# EAGLE design Stiquito (EAGLE 4.09)
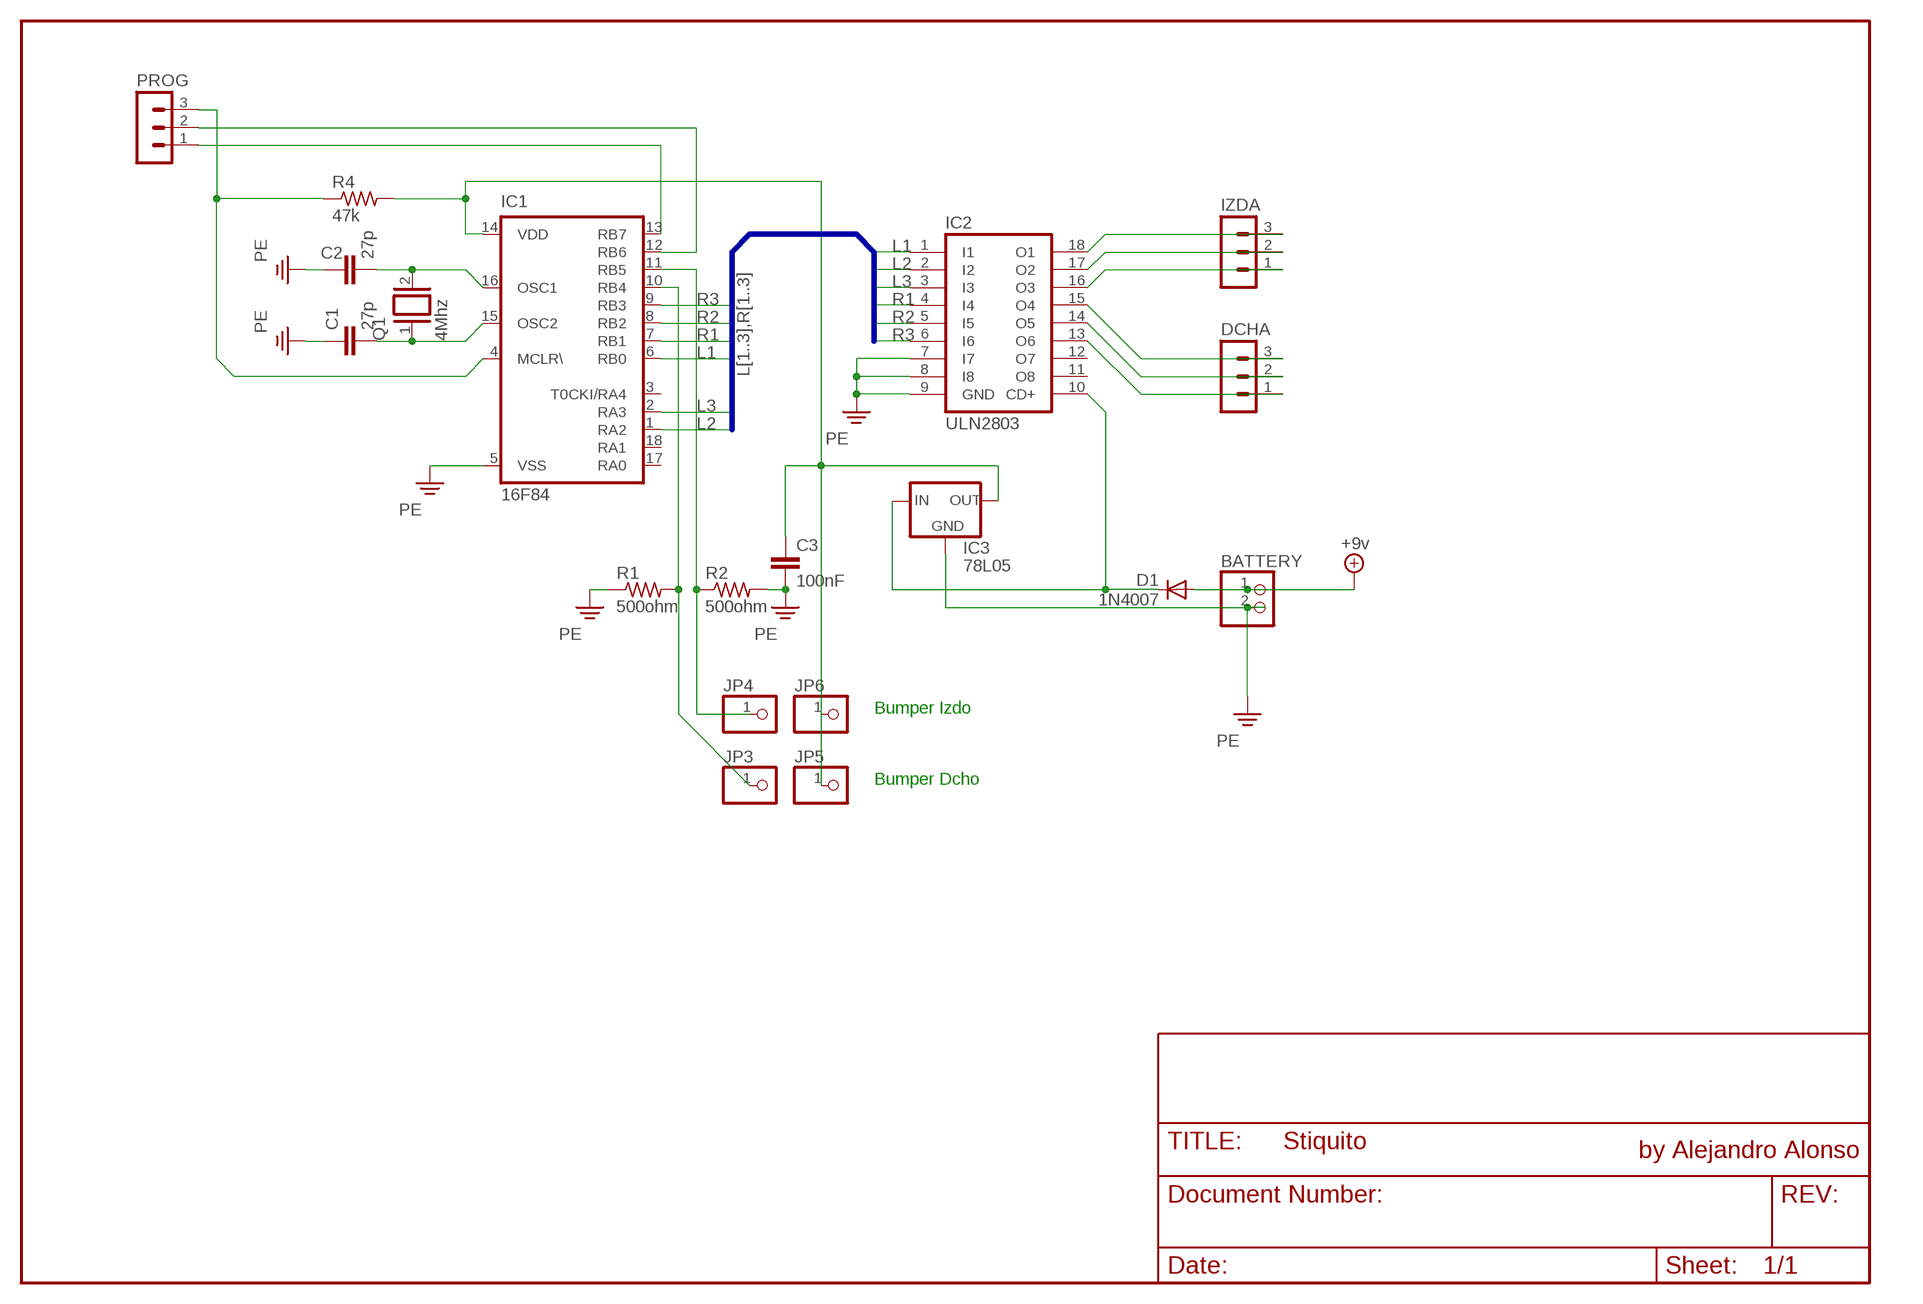
[diagram p0: schematic, sheet 1]

## Parts
BATTERY  PINHD-1X2  [1X02]
C1  27p  C5/2.5  [C5B2.5]
C2  27p  C5/2.5  [C5B2.5]
C3  100nF  C-EU050-030X075  [C050-030X075]
D1  1N4007  1N4004  [DO41-10]
DCHA  MA03-1  [MA03-1]
IC1  16F84  PIC16F84ASO  [SO-18W]
IC2  ULN2803  ULN2803A  [DIL18]
IC3  78L05  78LXX  [78LXX]
IZDA  MA03-1  [MA03-1]
JP3  PINHD-1X1  [1X01]
JP4  PINHD-1X1  [1X01]
JP5  PINHD-1X1  [1X01]
JP6  PINHD-1X1  [1X01]
PROG  MA03-1  [MA03-1]
Q1  4Mhz  XTAL/S  [QS]
R1  500ohm  R-US_0204/2V  [0204V]
R2  500ohm  R-US_0204/2V  [0204V]
R4  47k  R-US_0207/2V  [0207/2V]

## Nets
+5V: BATTERY.1 D1.A ; supply symbol labelled +9v
L1: IC1.6(RB0) IC2.1(I1)
L2: IC1.1(RA2) IC2.2(I2)
L3: IC1.2(RA3) IC2.3(I3)
N$2: IC1.12(RB6) PROG.2
N$6: D1.C IC2.10(CD+) IC3.IN
N$7: C2.2 IC1.16(OSC1) Q1.2
N$8: C1.2 IC1.15(OSC2) Q1.1
N$9: IC1.10(RB4) JP3.1 R1.2
N$10: IC1.11(RB5) JP4.1 R2.1
N$11: C3.1 IC1.14(VDD) IC3.OUT JP5.1 JP6.1 R4.2
N$12: IC2.18(O1) IZDA.3
N$13: IC1.13(RB7) PROG.1
N$15: IC2.17(O2) IZDA.2
N$16: IC2.16(O3) IZDA.1
N$17: DCHA.3 IC2.15(O4)
N$18: DCHA.2 IC2.14(O5)
N$19: DCHA.1 IC2.13(O6)
N$20: IC1.4(MCLR\) PROG.3 R4.1
PE: C1.1 C2.1 C3.2 IC1.5(VSS) IC2.7(I7) IC2.8(I8) IC2.9(GND) IC3.GND R1.1 R2.2
R1: IC1.7(RB1) IC2.4(I4)
R2: IC1.8(RB2) IC2.5(I5)
R3: IC1.9(RB3) IC2.6(I6)
Unconnected: BATTERY.2 IC1.3(T0CKI/RA4) IC1.17(RA0) IC1.18(RA1) IC2.11(O8) IC2.12(O7)

## Buses
L[1..3],R[1..3]

## Notes on the sheet
- Bumper Izdo
- Bumper Dcho
- by Alejandro Alonso

## Library data of the parts
BATTERY = pinhead:PINHD-1X2: PIN HEADER
C1 C2 = capacitor-wima:C: CAPACITOR naming: grid - package width
C3 = rcl:C-EU: CAPACITOR, European symbol
D1 = diode:1N4004: DIODE general purpose rectifier, 1 A
DCHA IZDA PROG = con-lstb:MA03-1: PIN HEADER
IC1 = microchip:PIC16F8*: MICROCONTROLLER 8-Bit PIC16F8X Family - CMOS Flash/EEPROM Pin Compatible : PIC16F83, PIC16CR83, PIC16F84A, PIC16CR84 see also PIC16C*
IC2 = uln-udn:ULN2803A: DRIVER ARRAY
IC3 = v-reg:78LXX: VOLTAGE REGULATOR
JP3-JP6 = pinhead:PINHD-1X1: PIN HEADER
Q1 = special:XTAL/S: CRYSTAL
R1 R2 R4 = rcl:R-US_: RESISTOR, American symbol

## Board
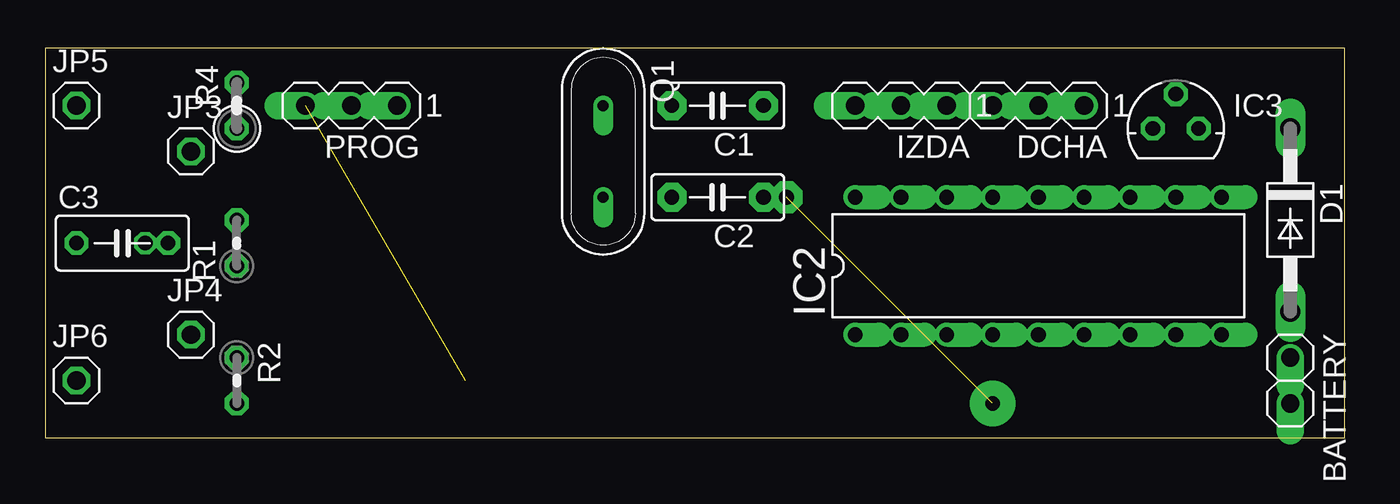
[diagram p1: board, top side]
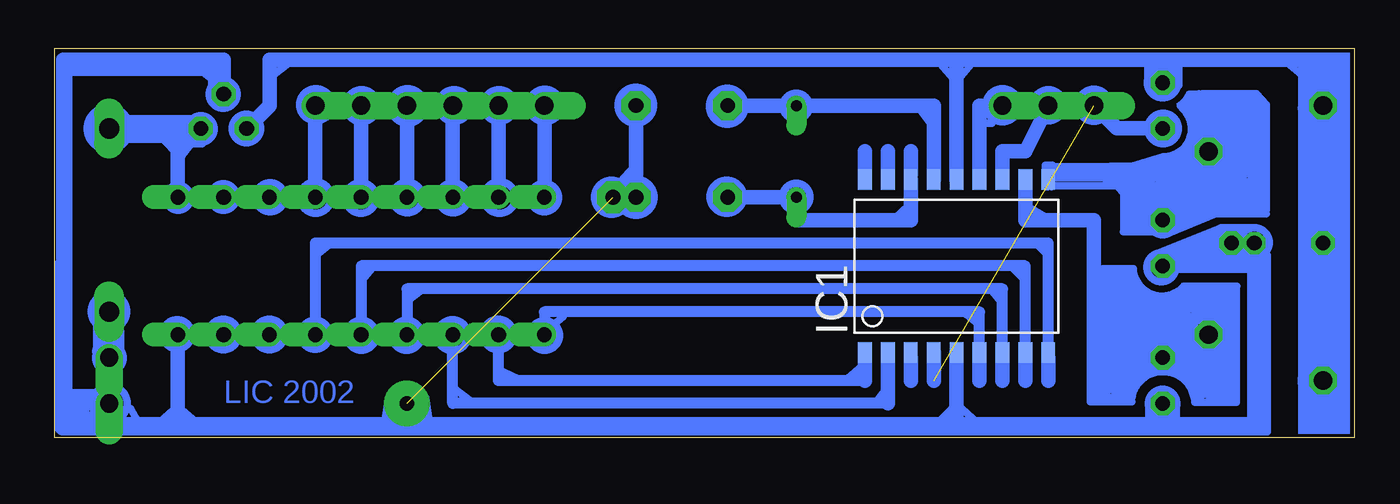
[diagram p2: board, bottom side, seen from below]

Size 72.06 x 21.58 mm. Coordinates in mm from the lower left corner, seen from the top.
Outline: 0,0 72.06,0 72.06,21.58 0,21.58 0,0
Copper layers used: Bottom

### Footprints (pad centres in the part's own frame; a part is rotated, then mirrored left to right if it is on the bottom)
1X02 = drill 1.016 offset: 1 -1.27,0; 2 1.27,0
C5B2.5 = drill 0.813 pad 1.6 octagon: 1 -2.54,0; 2 2.54,0
C050-030X075 = drill 0.813 octagon: 1 -2.54,0; 2 2.54,0
DO41-10 = drill 1.118 long: A 5.08,0; C -5.08,0
MA03-1 = drill 1.016 offset: 1 -2.54,0; 2 0,0; 3 2.54,0
SO-18W = smd 0.762 x 1.143: 1 -5.08,-4.788; 2 -3.81,-4.788; 3 -2.54,-4.788; 4 -1.27,-4.788; 5 0,-4.788; 6 1.27,-4.788; 7 2.54,-4.788; 8 3.81,-4.788; 9 5.08,-4.788; 10 5.08,4.788; 11 3.81,4.788; 12 2.54,4.788; 13 1.27,4.788; 14 0,4.788; 15 -1.27,4.788; 16 -2.54,4.788; 17 -3.81,4.788; 18 -5.08,4.788
DIL18 = drill 0.813 offset: 1 -10.16,-3.81; 2 -7.62,-3.81; 3 -5.08,-3.81; 4 -2.54,-3.81; 5 0,-3.81; 6 2.54,-3.81; 7 5.08,-3.81; 8 7.62,-3.81; 9 10.16,-3.81; 10 10.16,3.81; 11 7.62,3.81; 12 5.08,3.81; 13 2.54,3.81; 14 0,3.81; 15 -2.54,3.81; 16 -5.08,3.81; 17 -7.62,3.81; 18 -10.16,3.81
78LXX = drill 0.813 octagon: GND 0,1.905; IN 1.27,0; OUT -1.27,0
1X01 = drill 1.016 octagon: 1 0,0
QS = drill 0.61 offset: 1 -2.54,0; 2 2.54,0
0204V = drill 0.813 octagon: 1 -1.27,0; 2 1.27,0
0207/2V = drill 0.813 octagon: 1 -1.27,0; 2 1.27,0

### Placement (x,y rotation side)
BATTERY  69.05,3.17 270 top
C1  37.3,18.41 180 top
C2  37.3,13.33 180 top
C3  4.28,10.79 0 top
D1  69.05,12.06 270 top
DCHA  55.08,18.41 180 top
IC1  22.06,9.52 0 bottom
IC2  55.08,9.52 0 top
IC3  62.7,17.14 0 top
IZDA  47.46,18.41 180 top
JP3  8.09,15.87 0 top
JP4  8.09,5.71 0 top
JP5  1.74,18.41 0 top
JP6  1.74,3.17 0 top
PROG  16.98,18.41 180 top
Q1  30.95,15.87 270 top
R1  10.63,10.79 90 top
R2  10.63,3.17 270 top
R4  10.63,18.41 90 top

### Tracks (layer width: path | path; a pad name or v marks a point on that pad's centre or on a via)
+5V
  Bottom 0.813: BATTERY.1 D1.A
L1
  Bottom 0.61: IC1.6 20.79,6.98 44.92,6.98 IC2.1
L2
  Bottom 0.61: IC2.2 47.46,3.17 27.14,3.17
  Bottom 0.813: IC1.1 27.14,3.17
L3
  Bottom 0.61: IC2.3 50,1.9 25.87,1.9
  Bottom 0.813: 25.87,1.9 IC1.2
N$1
  Bottom 0.813: 25.87,14.6 25.87,15.87
N$2
  Bottom 0.813: IC1.12 19.52,15.87 18.25,15.87 PROG.2
N$3
  Bottom 0.813: 27.14,14.6 27.14,15.87
N$4  (via drill 0.81 pad 2.54)
  other vias: 52.54,1.9
N$5  (via drill 0.81 pad 1.78)
  other vias: 41.11,13.33
N$6
  Bottom 0.813: 65.24,17.14 D1.C | 65.24,17.14 IC3.IN | IC2.10 65.24,17.14
N$7
  Bottom 0.813: IC1.16 24.6,12.06 30.95,12.06 Q1.2 C2.2
N$8
  Bottom 0.813: IC1.15 23.33,18.41 Q1.1 C1.2
N$9
  Bottom 0.813: JP3.1 8.09,14.6 10.63,14.6 | R1.2 10.63,14.6 | 10.63,14.6 16.98,14.6 IC1.10
N$10
  Bottom 0.813: IC1.11 18.25,12.06 14.44,12.06 14.44,5.71 JP4.1 10.63,5.71 R2.1
N$11
  Bottom 0.813: JP6.1 C3.1 JP5.1 1.74,20.95 10.63,20.95 | 10.63,20.95 22.06,20.95 | 22.06,20.95 IC1.14 | 22.06,20.95 60.16,20.95 60.16,18.41 IC3.OUT | 10.63,20.95 R4.2
N$12
  Bottom 0.813: IC2.18 IZDA.3
N$13
  Bottom 0.813: IC1.13 20.79,18.41 PROG.1
N$14
  Bottom 0.813: 24.6,14.6 24.6,15.87
N$15
  Bottom 0.813: IC2.17 IZDA.2
N$16
  Bottom 0.813: IC2.16 IZDA.1
N$17
  Bottom 0.813: IC2.15 DCHA.3
N$18
  Bottom 0.813: IC2.14 DCHA.2
N$19
  Bottom 0.813: IC2.13 DCHA.1
N$20  (1 unrouted)
  Bottom 0.813: R4.1 13.17,17.14 PROG.3 | IC1.4 23.33,3.17
N$21
  Bottom 0.813: 16.98,4.44 16.98,3.17
N$22
  Bottom 0.813: 18.25,4.44 18.25,3.17
N$23
  Bottom 0.813: 19.52,4.44 19.52,3.17
N$24
  Bottom 0.813: 20.79,4.44 20.79,3.17
N$25
  Bottom 0.813: 24.6,4.44 24.6,3.17
N$26
  Bottom 0.406: 17,13.92 17.13,13.92 17.13,15.09 16.74,15.09
N$27
  Bottom 0.406: 9.1,16.17 9.47,15.09 10.63,14.7 9.19,15.43 10.22,14.77 8.98,15.23 10.1,14.35 10.38,13.79 9.36,14.32 10.22,13.29 8.79,14.32 10.14,12.91 7.22,15 9.95,12.67
N$28
  Bottom 0.406: 6.14,9.92 6.69,9.6 7.83,9.65 7.73,9.63 7.56,9.58 7.64,10.71 7.66,9.79 7.64,10.79 7.85,9.69 7.73,10.07 8.38,9.63 7.6,10.26
N$29
  Bottom 0.406: 7.75,4.5 9.87,4.23 9.19,4.65 9.63,5.33 10.06,5.39 9.49,4.67 10.14,3.89 7.54,4.59 10.61,3.68 8.56,6.87 11.56,5.86 9.42,6.26 11.47,5.16 11.39,4.31 11.94,5.54 13.34,5.54 11.18,5.05 9.93,6.39 14.2,6.39 14.2,6.13 10.48,6.2
N$30
  Bottom 0.406: 9.74,0.9 9.87,0.9 9.87,2.01 11.39,1.94 11.39,0.99
N$31
  Bottom 0.406: 11.13,19.62 11.45,19.62 11.45,20.72 9.74,20.74 9.74,19.53 10.04,20.61
N$32
  Bottom 0.406: 2.49,3.2 2.88,3.49 1.88,7.76 2.33,4.2 0.51,3.21 1.58,7.62 1.13,4.22 1.78,8.65 2.55,10.62 0.88,10.67 1.64,9 0.93,10.49 0.88,10.92 1.55,12.27 1.53,12.44 0.89,10.95 2.57,10.84 1.85,12.62 1.89,12.71 2.42,11.09 1.95,12.49 2.55,10.96 1.67,12.74 1.74,15.79 2.84,17.96 0.56,17.98 1.59,16.15 2.37,19.39 1.82,20.37 2.82,18.87 0.59,18.89 1.66,20.29
N$33
  Bottom 0.406: 1.86,15.4 2.77,18 0.56,17.95 1.63,15.23 0.67,17.95 2.65,17.78 1.8,14.78
N$34
  Bottom 0.406: 1.75,13.82 0.56,18.23 2.94,18.29 1.8,13.7
N$35
  Bottom 0.406: 20.88,0.8 22.07,1.88 23.2,0.69
N$36
  Bottom 0.406: 20.99,21 22.07,19.7 23.15,20.95
N$37
  Bottom 0.406: 53.77,0.86 53.55,2.16
N$38
  Bottom 0.406: 51.28,0.74 51.51,2.21
N$39
  Bottom 0.406: 69.8,2.5 71.21,2.5 69.89,2.49 71.12,2.11 70.91,1.03 70.12,1.2 71.01,2 70.65,1.24 70.61,2.17 70.29,2.17 70.35,1.41
N$40
  Bottom 0.406: 69.8,4.76 69.74,5.01 69.74,6.47 69.49,4.99 68.41,4.99 68.41,5.88 68.92,5.12
N$41
  Bottom 0.406: 63.88,16.29 65,16.29 64.68,16.74 64.36,17.67 68.11,17.67 68.17,16.55 65.28,16.55
N$42
  Bottom 0.406: 62.8,20.06 63.67,20.8
N$43
  Bottom 0.406: 59.94,20.12 59.1,20.76
N$44
  Bottom 0.406: 23.52,17.43 24.19,18.32
N$45
  Bottom 0.406: 20.6,17.44 20.09,17.44
N$46
  Bottom 0.406: 2.93,20.1 3.76,20.77
N$47
  Bottom 0.406: 13.13,13.98 16.95,13.98 16.84,15.01 10.37,15.07 9.23,15.83 9.06,16.19 9.58,15.51 8.82,16.49 8.79,17.55 8.93,16.32 8.82,17.88 9.09,18.34 9.28,18.34 8.93,18.75 8.9,19 8.38,19 8.63,18.64 8.52,17.14 7.86,17.14 8.33,18.67 8.33,17.25 7.4,17.31 7.89,18.13 7.92,18.81 7.38,16.83 5.18,16.7 7.33,17.11 5.08,17 7.37,17.45 5.15,17.37 7.63,17.83 5.07,17.78 8.22,18.77 5.43,18.83 7.87,18.44 5.11,18.49 7.67,18.16 5.05,18.15 5.18,16.15 7.08,16.49 5.26,16.45 6.8,16.08 5.05,15.79 6.79,15.66 5.09,15.49 7.16,15.35 5.13,15.12 5.13,12.74 9.54,12.98 9.63,11.99 7.96,12.73 9.62,12.7 9.61,12.27 8.91,12.58 8.87,13.4 6.65,15.07 5.11,14.87 5.41,12.79 8.9,13.31 6.21,14.94 5.12,14.44 5.94,12.75 8.49,13.57 5.9,14.66 5.21,13.85 6.58,12.83 8.04,13.81 5.46,14.29 6.8,12.91 7.46,13.94 5.51,13.85 7.34,13.49 6.32,13.21 13.78,14.31 11.65,13.74 12.78,13.67 12.44,11.57 12.41,13.77 11.95,13.62 12.19,11.65 12.17,14.02 11.85,11.52 11.56,11.7 11.46,13.19 11.83,13.57 11.74,12.15
N$48
  Bottom 0.406: 9.72,14.98 11.37,14.73 10.97,12.91 11.88,14.37 11.31,14.07 12.85,14.47 11.05,13.54 11.18,12.78 12.3,14.32 13.27,14.45
N$49
  Bottom 0.406: 12.8,11.41 10.4,11.41 7.67,12.61 4.89,12.61 4.89,18.45 5.43,19.05 8.44,19.05
N$50
  Bottom 0.406: 13.13,13.92 12.78,13.54 12.78,11.44 10.32,11.44
N$51
  Bottom 0.406: 16.81,13.92 16.81,15.1
N$52
  Bottom 0.406: 8.93,18.4 9.15,18.26 8.71,17.01 8.74,16.57 9.31,15.75 10.35,15.1
N$53
  Bottom 0.406: 7.78,19.04 8.91,19.04 8.91,18.69 9.29,18.32 8.8,17.55
N$54
  Bottom 0.406: 12.34,15.05 10.59,15.56 10.63,15.56 10.9,15.3
N$55
  Bottom 0.406: 5.62,0.43 5.65,0.33 4.84,0.33 4.84,10.11 5.11,9.27 5.18,0.4
N$56
  Bottom 0.406: 6.55,8.33 6.55,1.97 8.86,1.97 8.86,2.57
N$57
  Bottom 0.406: 12.35,2 14.61,2 14.61,7.19 14.64,7.19 14.64,2 12.58,2.2 14.38,2.26 14.32,5.56 14.04,2.08 13.93,5.65 13.72,2.25 13.54,5.39 13.27,2.05 13.21,5.52 12.88,2.21 12.83,5.75 12.49,2.2 12.38,5.68 12.15,3.02 11.96,5.25 11.8,3.54 11.54,4.34 11.48,3.68 6.65,4.97 9.85,3.62 6.6,4.59 9.56,3.44 6.65,4.2 9.18,3.29 6.67,3.88 9.12,2.99 6.7,3.52 8.93,2.81 6.67,3.2 8.6,2.6 6.67,2.88 8.73,2.34 6.76,2.5 8.04,2.1 6.76,2.23
N$58
  Bottom 0.406: 6.53,8.4 9.45,8.4 6.72,8.21 9.56,8.1 6.7,7.84 9.93,7.81 6.79,7.51 10.83,7.59 6.59,7.1 6.77,6.38 7.2,7.19 9.19,7.12 10.15,6.51 9.41,7.31 9.26,6.77 10.07,7.38 10.98,7.53 9.92,6.96 10.56,6.41 10.33,7.28 11.11,6.45 10.65,7.28 11.45,6.41 11.08,7.68 10.74,7.21 11.37,7.79 11.67,6.41 11.76,8.19 12.03,6.23 14.34,6.77 11.78,6.75 14.14,7.11 11.81,7.11 14.31,7.39 11.57,7.44 14.35,7.67 11.84,7.76 14.46,7.96 11.81,8.1 14.15,8.32 12.21,8.4 14.08,8.68 12.4,8.69 14.18,9.01 12.39,8.95 13.96,9.35 12.27,9.35
N$59
  Bottom 0.406: 5.5,11.63 7.41,11.63 11.06,10.17 7.56,11.23 10.34,10.06 7.61,10.85 9.9,9.89 7.59,10.45 8.81,9.81
N$60
  Bottom 0.406: 10.36,11.31 7.67,12.43 4.88,12.43
N$61
  Bottom 0.406: 8.62,19.05 9.15,19.04
N$62
  Bottom 0.406: 9.52,18.25 9.64,18.41
N$63
  Bottom 0.406: 71.38,2.17 71.28,2.7 71.28,20.6 71.23,20.26 62.94,20.26 62.94,20.55 71.33,20.45 63.37,20.4 63.37,18.91 62.99,20.21
N$64
  Bottom 0.406: 66.22,0.87 65.25,1.74 64.05,0.73
N$65
  Bottom 0.406: 65.45,15.92 66.22,16.74
N$66
  Bottom 0.406: 65.01,15.63 64.48,16.31
N$67
  Bottom 0.406: 67.47,0.92 67.86,1.59
N$68
  Bottom 0.406: 63.33,19.83 64,20.36
N$69
  Bottom 0.406: 57.59,10.08 56.86,10.66
N$70
  Bottom 0.406: 55.03,8.73 54.45,9.41
N$71
  Bottom 0.406: 52.52,7.58 51.7,8.2
N$72
  Bottom 0.406: 48.95,1.98 50.02,2.8
N$73
  Bottom 0.406: 46.49,3.33 47.51,3.81
N$74
  Bottom 0.406: 44.42,6.27 43.89,6.71
N$75
  Bottom 0.406: 40.71,14.18 39.98,15
N$76
  Bottom 0.406: 28.07,3.28 27.25,4.01
N$77
  Bottom 0.406: 26.58,1.88 26.14,2.46
N$78
  Bottom 0.406: 25.47,12.16 24.7,12.88
N$79
  Bottom 0.406: 17.17,12.25 18.04,12.79
N$80
  Bottom 0.406: 17.03,10.13 17.56,10.66
N$81
  Bottom 0.406: 18.33,8.78 19.05,9.51
N$82
  Bottom 0.406: 19.63,7.53 20.21,8.25
N$83
  Bottom 0.406: 20.84,6.27 21.51,6.8
PE  (via drill 0.81 pad 1.02, 0.81 pad 1.68)  (1 unrouted)
  Bottom 0.406: 65.24,0.63 66.51,0.63 | v41.11,13.33 C2.1 | IC2.7 IC2.8 IC2.9 | 52.54,0.63 v52.54,1.9
  Bottom 0.813: 10.63,0.63 R2.2 | 22.06,0.63 IC1.5 | 5.55,0.63 v5.55,10.79 | v5.55,10.79 5.55,9.52 R1.1 | C2.1 C1.1 | 69.05,0.63 69.05,1.9 | 65.24,0.63 IC2.9 IC2.7 | v5.55,10.79 C3.2 | IC3.GND 62.7,20.95 71.59,20.95 71.59,9.52
  Bottom 1.016: 5.55,0.63 10.63,0.63 22.06,0.63 52.54,0.63 65.24,0.63 69.05,0.63 71.59,0.63 71.59,9.52
R1
  Bottom 0.61: IC2.4 52.54,8.25 19.52,8.25 IC1.7
R2
  Bottom 0.61: IC2.5 55.08,9.52 18.25,9.52 IC1.8
R3
  Bottom 0.61: IC2.6 57.62,10.79 16.98,10.79 IC1.9
(copper drawn outside any net)
  Bottom 0.406: 9.44,18.49 arc148 10.76,15.23 | 9.59,18.31 arc141 10.63,15.57 | 8.86,2.04 arc-173 12.38,1.97 | 9.4,8.47 arc139 12.27,9.38 | 9.12,19.12 arc36 9.75,18.36
  shapes: Bottom area x1, Bottom circle x59

### Text on the board
Bottom: LIC 2002